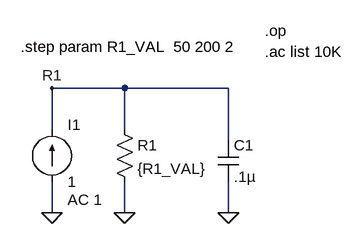
[diagram p0: schematic x_axix_param_ac1.asc]
x_axix_param_ac1.asc, the LTspice schematic file:
Version 4
SHEET 1 880 680
WIRE -64 160 -64 96
WIRE -64 288 -64 240
WIRE 48 96 -64 96
WIRE 48 160 48 96
WIRE 48 288 48 240
WIRE 208 96 48 96
WIRE 208 176 208 96
WIRE 208 288 208 240
FLAG -64 288 0
FLAG 48 288 0
FLAG -64 96 R1
FLAG 208 288 0
SYMBOL res 32 144 R0
SYMATTR InstName R1
SYMATTR Value {R1_VAL}
SYMBOL current -64 240 M180
WINDOW 0 24 88 Left 0
WINDOW 3 24 0 Left 0
WINDOW 123 24 -28 Left 0
WINDOW 39 24 -28 Left 0
SYMATTR InstName I1
SYMATTR Value 1
SYMATTR Value2 AC 1
SYMBOL cap 192 176 R0
SYMATTR InstName C1
SYMATTR Value .1µ
TEXT -112 32 Left 0 !.step param R1_VAL  50 200 2
TEXT 264 8 Left 0 !.op
TEXT 264 40 Left 0 !.ac list 10K

The netlist it stands for:
* x_axix_param_ac1.asc
R1 R1 0 {R1_VAL}
I1 0 R1 1 AC 1
C1 R1 0 .1µ
.step param R1_VAL  50 200 2
.op
.ac list 10K
.backanno
.end